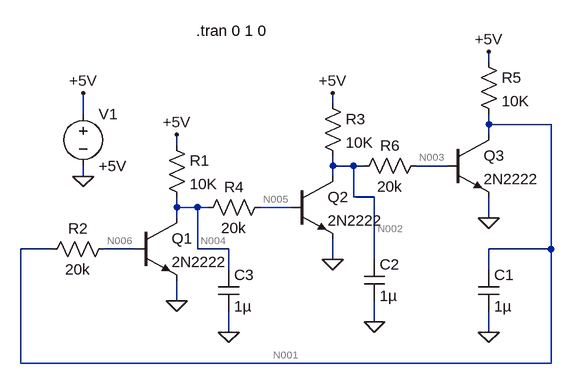
[diagram p0: schematic oscilador.asc]
oscilador.asc, the LTspice schematic file:
Version 4
SHEET 1 880 680
WIRE 688 -96 688 -112
WIRE 448 -32 448 -48
WIRE 64 -16 64 -48
WIRE 688 0 688 -16
WIRE 784 0 688 0
WIRE 688 16 688 0
WIRE 208 32 208 16
WIRE 448 64 448 48
WIRE 480 64 448 64
WIRE 496 64 480 64
WIRE 624 64 576 64
WIRE 64 80 64 64
WIRE 448 80 448 64
WIRE 480 112 480 64
WIRE 512 112 480 112
WIRE 208 128 208 112
WIRE 240 128 208 128
WIRE 256 128 240 128
WIRE 384 128 336 128
WIRE 208 144 208 128
WIRE 688 144 688 112
WIRE 16 192 -32 192
WIRE 144 192 96 192
WIRE 240 192 240 128
WIRE 288 192 240 192
WIRE 784 192 784 0
WIRE 784 192 688 192
WIRE 448 208 448 176
WIRE 512 208 512 112
WIRE 288 224 288 192
WIRE 688 224 688 192
WIRE 208 272 208 240
WIRE 512 304 512 272
WIRE 288 320 288 288
WIRE 688 320 688 288
WIRE -32 368 -32 192
WIRE 784 368 784 192
WIRE 784 368 -32 368
FLAG 64 80 0
FLAG 208 272 0
FLAG 64 -48 +5V
FLAG 208 16 +5V
FLAG 448 208 0
FLAG 448 -48 +5V
FLAG 688 144 0
FLAG 688 -112 +5V
FLAG 688 320 0
FLAG 512 304 0
FLAG 288 320 0
SYMBOL npn 144 144 R0
SYMATTR InstName Q1
SYMATTR Value 2N2222
SYMBOL res 192 16 R0
SYMATTR InstName R1
SYMATTR Value 10K
SYMBOL res 112 176 R90
WINDOW 0 0 56 VBottom 2
WINDOW 3 32 56 VTop 2
SYMATTR InstName R2
SYMATTR Value 20k
SYMBOL voltage 64 -32 R0
SYMATTR InstName V1
SYMATTR Value +5V
SYMBOL npn 384 80 R0
SYMATTR InstName Q2
SYMATTR Value 2N2222
SYMBOL res 432 -48 R0
SYMATTR InstName R3
SYMATTR Value 10K
SYMBOL res 352 112 R90
WINDOW 0 0 56 VBottom 2
WINDOW 3 32 56 VTop 2
SYMATTR InstName R4
SYMATTR Value 20k
SYMBOL npn 624 16 R0
SYMATTR InstName Q3
SYMATTR Value 2N2222
SYMBOL res 672 -112 R0
SYMATTR InstName R5
SYMATTR Value 10K
SYMBOL res 592 48 R90
WINDOW 0 0 56 VBottom 2
WINDOW 3 32 56 VTop 2
SYMATTR InstName R6
SYMATTR Value 20k
SYMBOL cap 672 224 R0
SYMATTR InstName C1
SYMATTR Value 1µ
SYMATTR SpiceLine V=100 Irms=4.58 Rser=0.025 Lser=0 mfg="KEMET" pn="C2225C105K1RAC" type="X7R"
SYMBOL cap 496 208 R0
SYMATTR InstName C2
SYMATTR Value 1µ
SYMATTR SpiceLine V=100 Irms=4.58 Rser=0.025 Lser=0 mfg="KEMET" pn="C2225C105K1RAC" type="X7R"
SYMBOL cap 272 224 R0
SYMATTR InstName C3
SYMATTR Value 1µ
SYMATTR SpiceLine V=100 Irms=4.58 Rser=0.025 Lser=0 mfg="KEMET" pn="C2225C105K1RAC" type="X7R"
TEXT 238 -144 Left 2 !.tran 0 1 0

The netlist it stands for:
* oscilador.asc
Q1 N004 N006 0 0 2N2222
R1 +5V N004 10K
R2 N006 N001 20k
V1 +5V 0 +5V
Q2 N002 N005 0 0 2N2222
R3 +5V N002 10K
R4 N005 N004 20k
Q3 N001 N003 0 0 2N2222
R5 +5V N001 10K
R6 N003 N002 20k
C1 N001 0 1µ V=100 Irms=4.58 Rser=0.025 Lser=0 mfg="KEMET" pn="C2225C105K1RAC" type="X7R"
C2 N002 0 1µ V=100 Irms=4.58 Rser=0.025 Lser=0 mfg="KEMET" pn="C2225C105K1RAC" type="X7R"
C3 N004 0 1µ V=100 Irms=4.58 Rser=0.025 Lser=0 mfg="KEMET" pn="C2225C105K1RAC" type="X7R"
.model NPN NPN
.model PNP PNP
.lib standard.bjt
.tran 0 1 0
.backanno
.end

* Results of the author's LTspice run, read from the files saved beside the schematic
* Operating Point, zero values left out:
*   V(n004) = 676.5 mV
*   V(n006) = 633.4 mV
*   V(+5v) = 5 V
*   V(n001) = 676.5 mV
*   V(n002) = 676.5 mV
*   V(n005) = 633.4 mV
*   V(n003) = 633.4 mV
*   Ic(Q3) = 430.2 µA
*   Ib(Q3) = 2.153 µA
*   Ie(Q3) = -432.4 µA
*   Ic(Q2) = 430.2 µA
*   Ib(Q2) = 2.153 µA
*   Ie(Q2) = -432.4 µA
*   Ic(Q1) = 430.2 µA
*   Ib(Q1) = 2.153 µA
*   Ie(Q1) = -432.4 µA
*   I(R6) = -2.153 µA
*   I(R5) = 432.4 µA
*   I(R4) = -2.153 µA
*   I(R3) = 432.4 µA
*   I(R2) = -2.153 µA
*   I(R1) = 432.4 µA
*   I(V1) = -1.297 mA
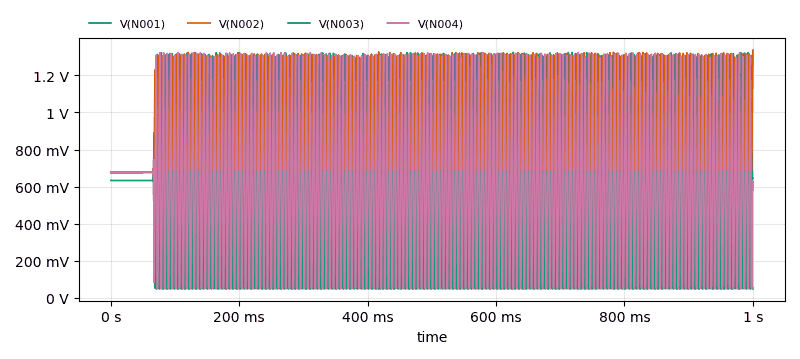
[diagram p1: Transient Analysis of oscilador.asc, plotted from the saved traces]
* Transient Analysis, 1 run:
*   V(N001): min 49.47 mV, max 1.324 V, average 590.6 mV, rms 739.7 mV, last 49.47 mV
*   V(N002): min 49.62 mV, max 1.335 V, average 591.4 mV, rms 740.3 mV, last 1.335 V
*   V(N003): min 49.68 mV, max 685 mV, average 421.1 mV, rms 494.5 mV, last 643.7 mV
*   V(N004): min 49.6 mV, max 1.324 V, average 590.5 mV, rms 739.7 mV, last 629.8 mV